# EAGLE design sw_xz (EAGLE 6.5.0)
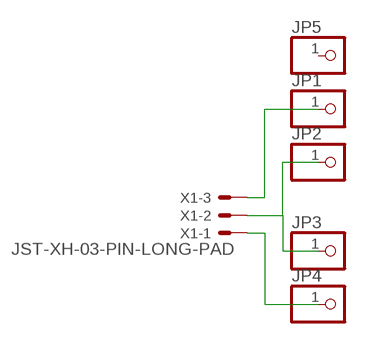
[diagram p0: schematic, sheet 1]

## Parts
JP1  PINHD-1X1  [1X01]
JP2  PINHD-1X1  [1X01]
JP3  PINHD-1X1  [1X01]
JP4  PINHD-1X1  [1X01]
JP5  PINHD-1X1  [1X01]
X1  JST-XH-03-PIN-LONG-PAD  [JST-XH-03-PACKAGE-LONG-PAD]

## Nets
N$1: JP1.1 X1.3
N$2: JP2.1 JP3.1 X1.2
N$3: JP4.1 X1.1
Unconnected: JP5.1

## Library data of the parts
JP1-JP5 = pinhead:PINHD-1X1: PIN HEADER
X1 = Rembrandt Electronics - JST XH Connectors v1-0:JST-XH-03-PIN: JST XH Connector 2 Pin Wire to board connector. Pitch: 2,54 mm, (0.100") Number of pins: 3 Created by Rembrandt Electronics www.rembrandtelectronics.com

## Board
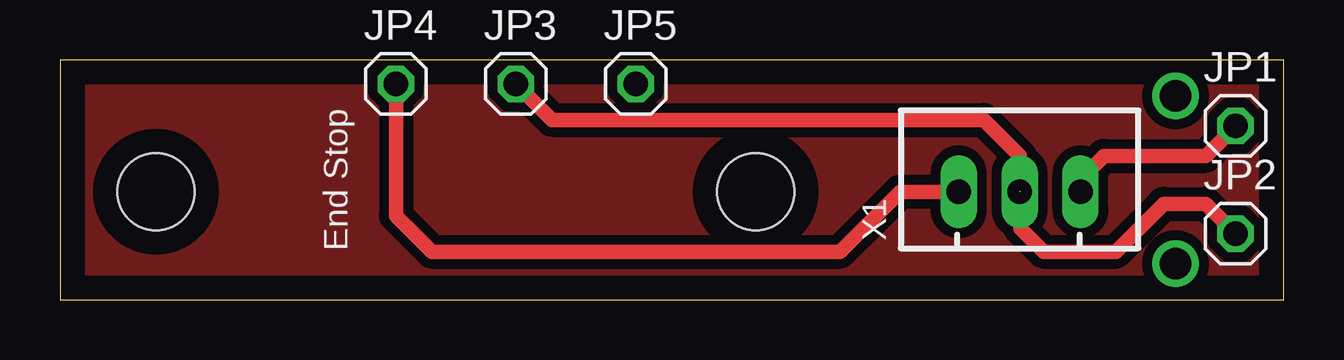
[diagram p1: board, top side]
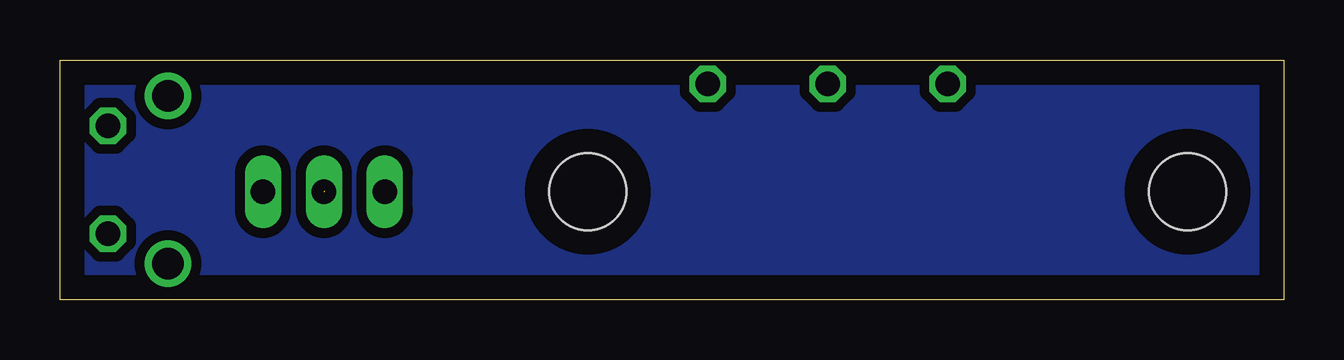
[diagram p2: board, bottom side, seen from below]

Size 51 x 10 mm. Coordinates in mm from the lower left corner, seen from the top.
Outline: 0,0 51,0 51,10 0,10 0,0
Copper layers (1*16): Top 0.035mm / dielectric 1.5mm / Bottom 0.035mm
Design rules "default": minimum track width 10mil, minimum drill 24mil, track to track 8mil, track to pad 8mil, pad to pad 8mil, via to via 8mil, smd to smd 8mil, copper to edge 40mil, drill to drill 8mil, minimum pad ring 10mil, minimum via ring 8mil, stop-mask expansion 4mil, vias tented up to drill 0mil, thermal gap 10mil
Holes 3.2 mm at 29,4.5 4,4.5

### Footprints (pad centres in the part's own frame; a part is rotated, then mirrored left to right if it is on the bottom)
1X01 = drill 1.016 octagon: 1 0,0
JST-XH-03-PACKAGE-LONG-PAD = drill 1.016 long: 1 -2.54,0; 2 0,0; 3 2.54,0

### Placement (x,y rotation side)
JP1  49,7.25 0 top
JP2  49,2.75 0 top
JP3  19,9 0 top
JP4  14,9 0 top
JP5  24,9 0 top
X1  40,4.5 0 top

### Tracks (layer width: path | path; a pad name or v marks a point on that pad's centre or on a via)
N$1
  Top 0.61: JP1.1 47.75,6 43.5,6 42.5,5 42.5,4.5 X1.3
N$2  (1 unrouted)
  Top 0.61: JP3.1 20.5,7.5 38.5,7.5 40,6 40,4.54 | JP2.1 47.75,4 46,4 44,2 41,2 40.04,2.96 40,3.96 X1.2
N$3
  Top 0.61: JP4.1 14,3.5 15.5,2 32.5,2 35,4.5 X1.1
N$4  (via drill 1.3)
  other vias: 46.5,8.5
N$5  (via drill 1.3)
  other vias: 46.5,1.5
N$6
  pour Top (isolate 0.406): 1,9 50,9 50,1 1,1
N$7
  pour Bottom (isolate 0.406): 1,9 50,9 50,1 1,1

### Text on the board
tPlace: End Stop
tOrigins: X / Z